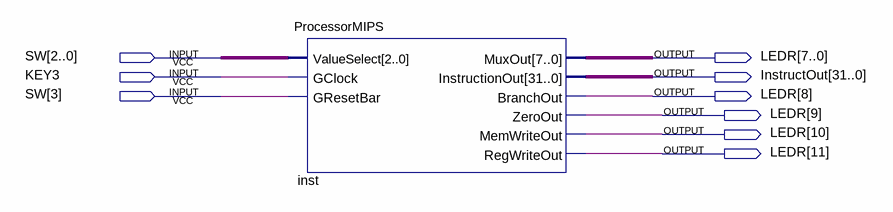
[diagram p0: schematic sheet]
// Quartus schematic TopLevelMIPS.bdf as structural Verilog: 1 symbols, 9 pins
module TopLevelMIPS (
  input  [3:0] SW,
  input  KEY3,
  output [11:0] LEDR,
  output [31:0] InstructOut
);

  ProcessorMIPS inst (
    .ValueSelect(SW[2:0]), .GClock(KEY3), .GResetBar(SW[3]), .MuxOut(LEDR[7:0]),
    .InstructionOut(InstructOut), .BranchOut(LEDR[8]), .ZeroOut(LEDR[9]), .MemWriteOut(LEDR[10]),
    .RegWriteOut(LEDR[11]));
endmodule
